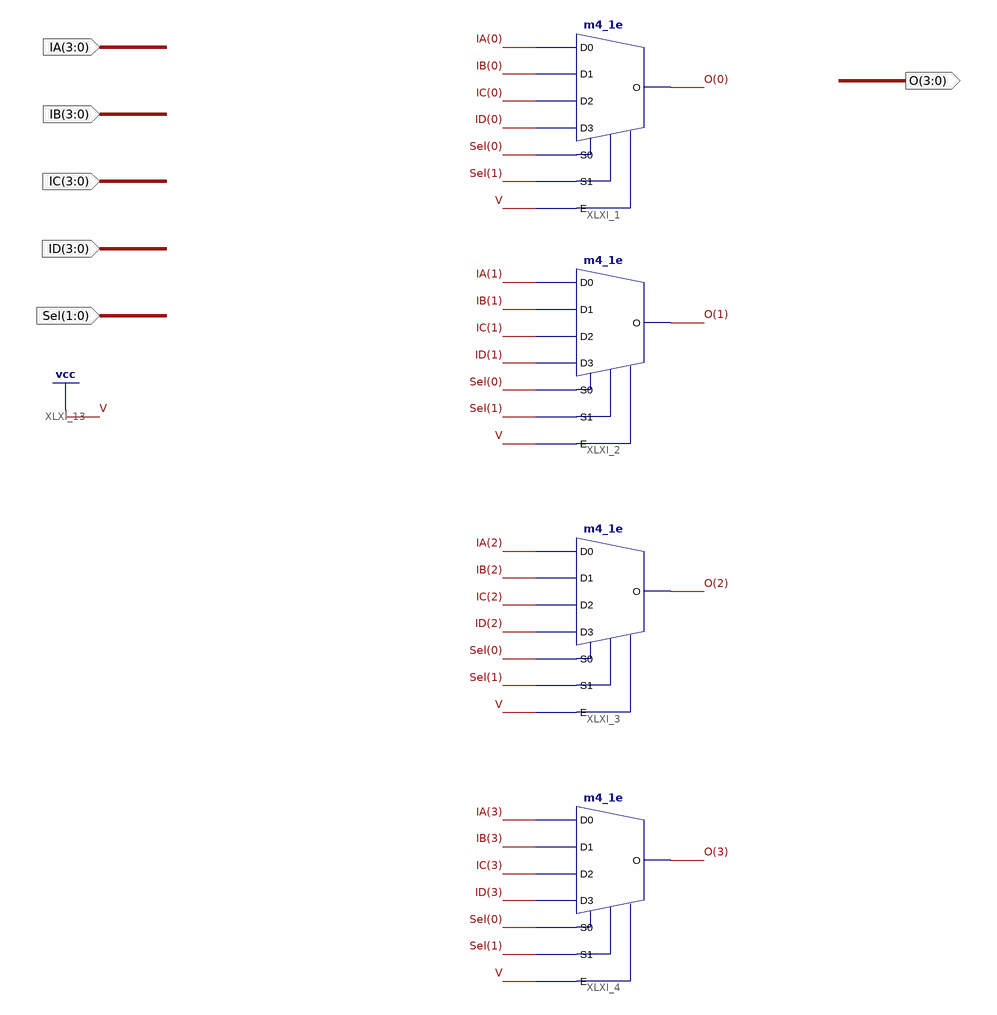
[diagram p0: schematic sheet 1]
// Xilinx ISE schematic mux4b4.sch (spartan3e) as structural Verilog: 4 symbols, 6 ports
module mux4b4 (
  input  [3:0] IA,
  input  [3:0] IB,
  input  [3:0] IC,
  input  [3:0] ID,
  input  [1:0] Sel,
  output [3:0] O
);

  m4_1e XLXI_1 (.D0(IA[0]), .D1(IB[0]), .D2(IC[0]), .D3(ID[0]), .E(1'b1), .S0(Sel[0]), .S1(Sel[1]), .O(O[0]));
  m4_1e XLXI_2 (.D0(IA[1]), .D1(IB[1]), .D2(IC[1]), .D3(ID[1]), .E(1'b1), .S0(Sel[0]), .S1(Sel[1]), .O(O[1]));
  m4_1e XLXI_3 (.D0(IA[2]), .D1(IB[2]), .D2(IC[2]), .D3(ID[2]), .E(1'b1), .S0(Sel[0]), .S1(Sel[1]), .O(O[2]));
  m4_1e XLXI_4 (.D0(IA[3]), .D1(IB[3]), .D2(IC[3]), .D3(ID[3]), .E(1'b1), .S0(Sel[0]), .S1(Sel[1]), .O(O[3]));
endmodule
